# EAGLE design serduchotron 2 (EAGLE 8.3.2)
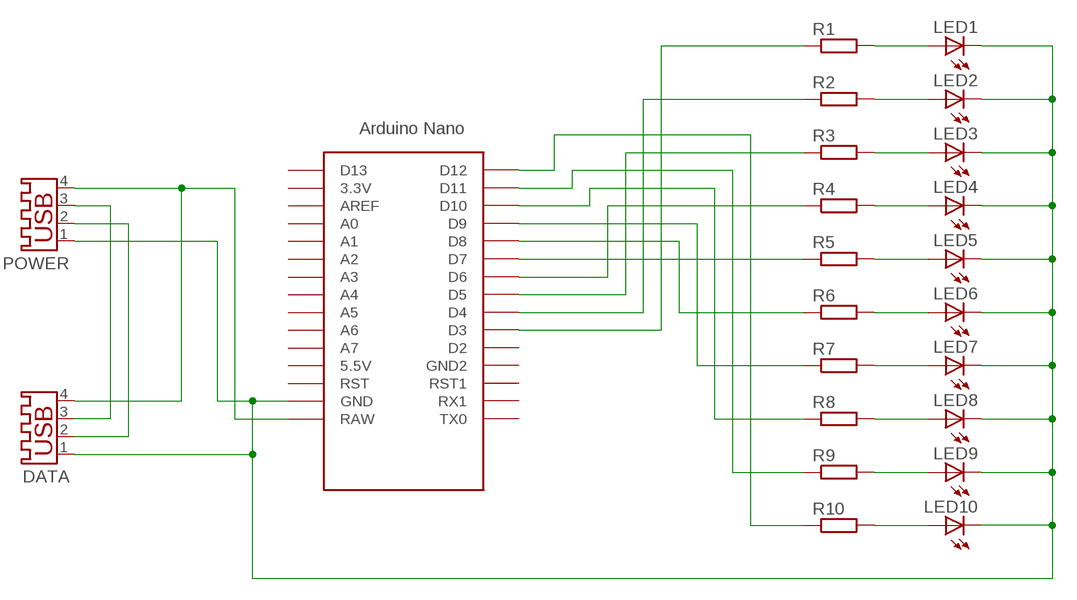
[diagram p0: schematic, sheet 1]

## Parts
DATA  USB-A003  [USB-A003]
LED1  LEDCHIP-LED0805  [CHIP-LED0805]
LED2  LEDCHIP-LED0805  [CHIP-LED0805]
LED3  LEDCHIP-LED0805  [CHIP-LED0805]
LED4  LEDCHIP-LED0805  [CHIP-LED0805]
LED5  LEDCHIP-LED0805  [CHIP-LED0805]
LED6  LEDCHIP-LED0805  [CHIP-LED0805]
LED7  LEDCHIP-LED0805  [CHIP-LED0805]
LED8  LEDCHIP-LED0805  [CHIP-LED0805]
LED9  LEDCHIP-LED0805  [CHIP-LED0805]
LED10  LEDCHIP-LED0805  [CHIP-LED0805]
POWER  USB-A003  [USB-A003]
R1  R-EU_M0805  [M0805]
R2  R-EU_M0805  [M0805]
R3  R-EU_M0805  [M0805]
R4  R-EU_M0805  [M0805]
R5  R-EU_M0805  [M0805]
R6  R-EU_M0805  [M0805]
R7  R-EU_M0805  [M0805]
R8  R-EU_M0805  [M0805]
R9  R-EU_M0805  [M0805]
R10  R-EU_M0805  [M0805]
U$1  NANO  [NANO]

## Nets
DATA+: DATA.2 POWER.2
DATA-: DATA.3 POWER.3
GND: DATA.1 LED1.C LED2.C LED3.C LED4.C LED5.C LED6.C LED7.C LED8.C LED9.C LED10.C POWER.1 U$1.GND
LED1: LED1.A R1.2
LED2: LED2.A R2.2
LED3: LED3.A R3.2
LED4: LED4.A R4.2
LED5: LED5.A R5.2
LED6: LED6.A R6.2
LED7: LED7.A R7.2
LED8: LED8.A R8.2
LED9: LED9.A R9.2
LED10: LED10.A R10.2
R1: R1.1 U$1.D3
R2: R2.1 U$1.D4
R3: R3.1 U$1.D5
R4: R4.1 U$1.D6
R5: R5.1 U$1.D7
R6: R6.1 U$1.D8
R7: R7.1 U$1.D9
R8: R8.1 U$1.D10
R9: R9.1 U$1.D11
R10: R10.1 U$1.D12
VCC: DATA.4 POWER.4 U$1.RAW
Unconnected: U$1.3.3V U$1.5V(5.5V) U$1.A0 U$1.A1 U$1.A2 U$1.A3 U$1.A4 U$1.A5 U$1.A6 U$1.A7 U$1.AREF U$1.D2 U$1.D13 U$1.GND1(GND2) U$1.ICSP1 U$1.ICSP2 U$1.ICSP3 U$1.ICSP4 U$1.ICSP5 U$1.ICSP6 U$1.RST U$1.RST1 U$1.RX1 U$1.TX0

## Library data of the parts
DATA POWER = con-yamaichi:USB-A003: USB connector; OC_FARNELL: unknown; OC_NEWARK: unknown
LED1-LED10 = led:LED: LED OSRAM: - CHIPLED LG R971, LG N971, LY N971, LG Q971, LY Q971, LO R971, LY R971 LH N974, LH R974 LS Q976, LO Q976, LY Q976 LO Q996 - Hyper CHIPLED LW Q18S LB Q993, LB Q99A, LB R99A - SideLED LS A670, LO A670, LY A670, LG A670, LP A670 LB A673, LV A673, LT A673, LW A673 LH A674 LY A675 LS A676, LA A676, LO A676, LY A676, LW A676 LS A679, LY A679, LG A679 - Hyper Micro SIDELED® LS Y876, LA Y876, LO Y876, LY Y876 LT Y87S - SmartLED LW L88C, LW L88S LB L89C, LB L89S, LG L890 LS L89K, LO L89K, LY L89K LS L896, LA L896, LO L896, LY L896 - TOPLED LS T670, LO T670, LY T670, LG T670, LP T670 LSG T670, LSP T670, LSY T670, LOP T670, LYG T670 LG T671, LOG T671, LSG T671 LB T673, LV T673, LT T673, LW T673 LH T674 LS T676, LA T676, LO T676, LY T676, LB T676, LH T676, LSB T676, LW T676 LB T67C, LV T67C, LT T67C, LS T67K, LO T67K, LY T67K, LW E67C LS E67B, LA E67B, LO E67B, LY E67B, LB E67C, LV E67C, LT E67C LW T67C LS T679, LY T679, LG T679 LS T770, LO T770, LY T770, LG T770, LP T770 LB T773, LV T773, LT T773, LW T773 LH T774 LS E675, LA E675, LY E675, LS T675 LS T776, LA T776, LO T776, LY T776, LB T776 LHGB T686 LT T68C, LB T68C - Hyper Mini TOPLED® LB M676 - Mini TOPLED Santana® LG M470 LS M47K, LO M47K, LY M47K Source: http://www.osram.convergy.de LUXEON: - LUMILED® LXK2-PW12-R00, LXK2-PW12-S00, LXK2-PW14-U00, LXK2-PW14-V00 LXK2-PM12-R00, LXK2-PM12-S00, LXK2-PM14-U00 LXK2-PE12-Q00, LXK2-PE12-R00, LXK2-PE12-S00, LXK2-PE14-T00, LXK2-PE14-U00 LXK2-PB12-K00, LXK2-PB12-L00, LXK2-PB12-M00, LXK2-PB14-N00, LXK2-PB14-P00, LXK2-PB14-Q00 LXK2-PR12-L00, LXK2-PR12-M00, LXK2-PR14-Q00, LXK2-PR14-R00 LXK2-PD12-Q00, LXK2-PD12-R00, LXK2-PD12-S00 LXK2-PH12-R00, LXK2-PH12-S00 LXK2-PL12-P00, LXK2-PL12-Q00, LXK2-PL12-R00 Source: www.luxeon.com KINGBRIGHT: KA-3528ASYC Source: www.kingbright.com
R1-R10 = rcl:R-EU_: RESISTOR, European symbol
U$1 = Arduino-clone:NANO: Arduino Nano

## Board
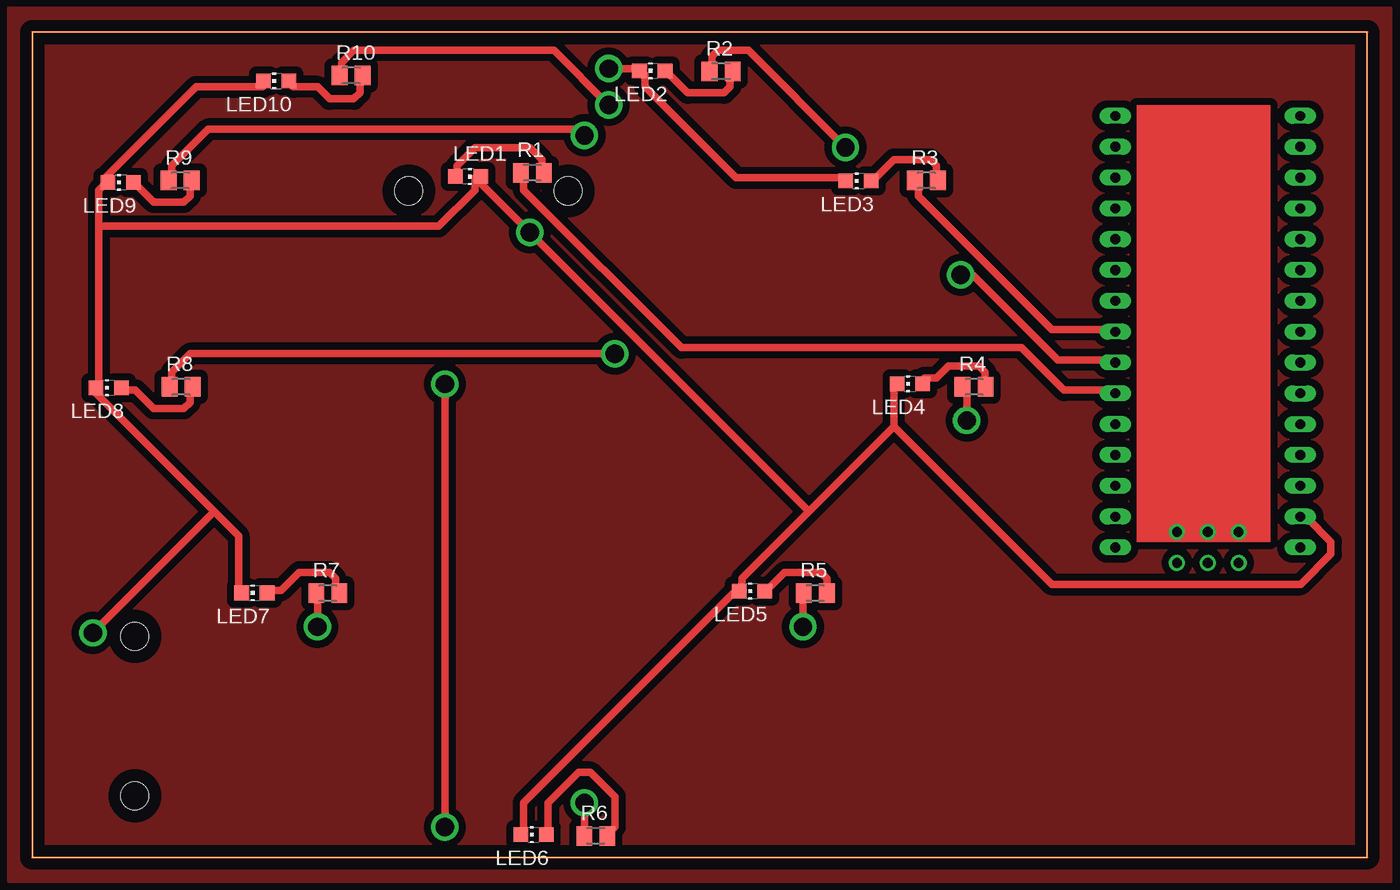
[diagram p1: board, top side]
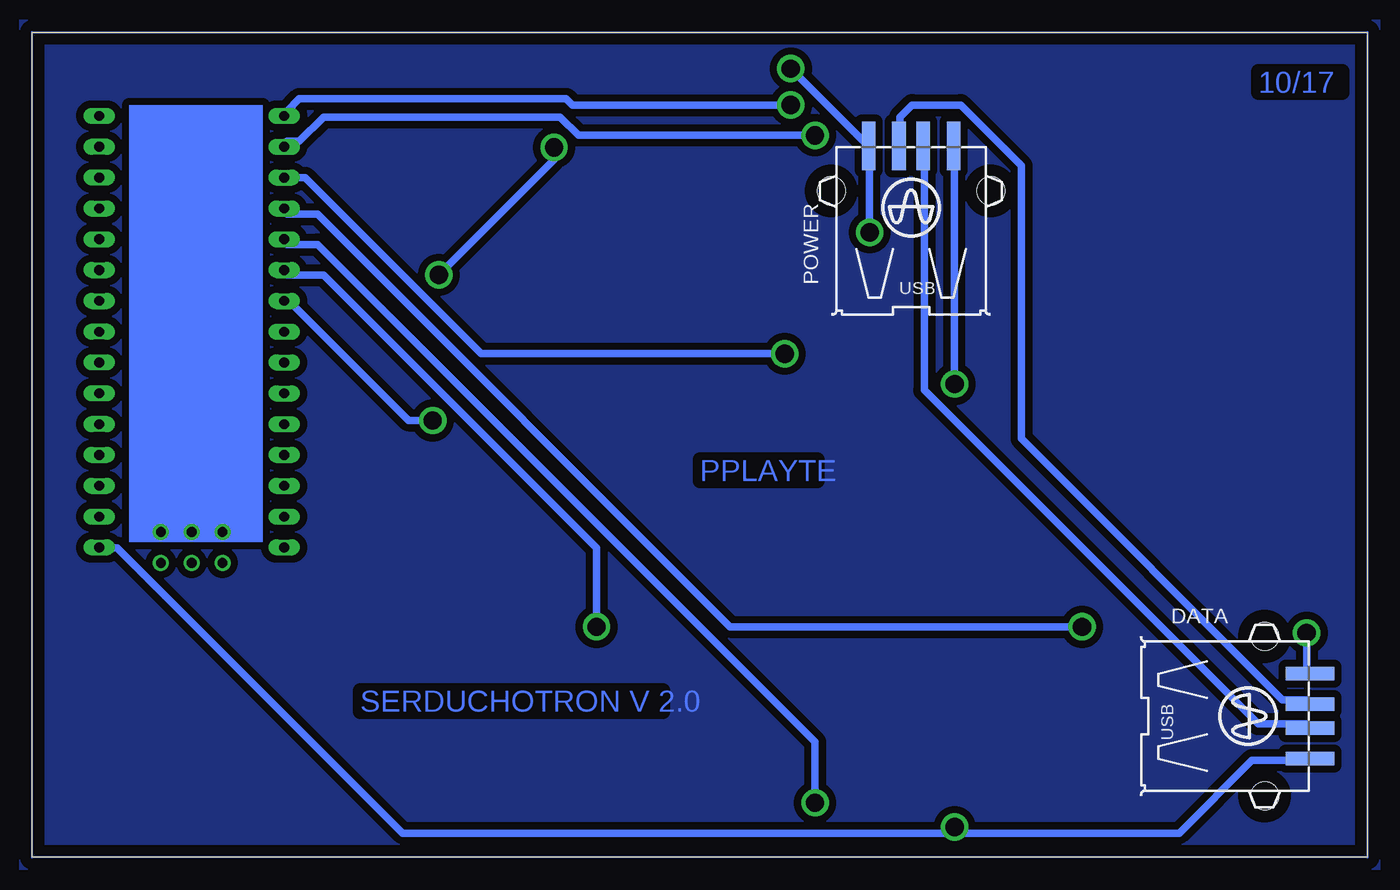
[diagram p2: board, bottom side, seen from below]

Size 110 x 68 mm. Coordinates in mm from the lower left corner, seen from the top.
Outline: 0,0 110,0 110,68 0,68 0,0
Copper layers (1*16): Top 0.035mm / dielectric 1.5mm / Bottom 0.035mm
Design rules "default *": minimum track width 0.6mm, minimum drill 1.5mm, track to track 0.6mm, track to pad 0.6mm, pad to pad 0.6mm, via to via 0.6mm, smd to smd 0.6mm, copper to edge 40mil, drill to drill 6mil, minimum pad ring 10mil, minimum via ring 8mil, stop-mask expansion 4mil, vias tented up to drill 0mil, thermal gap 10mil

### Footprints (pad centres in the part's own frame; a part is rotated, then mirrored left to right if it is on the bottom)
USB-A003 = smd 1.12 x 4: 1 -3.5,14; 2 -1,14; 3 1,14; 4 3.5,14 | hole 2.3: -6.57,10.28; 6.57,10.28
CHIP-LED0805 = smd 1.2 x 1.2: A 0,-1.05; C 0,1.05
M0805 = smd 1.3 x 1.6: 1 -0.95,0; 2 0.95,0
NANO = drill 0.8 long: 3.3V -10.16,24.13; 5V -10.16,-1.27; A0 -10.16,19.05; A1 -10.16,16.51; A2 -10.16,13.97; A3 -10.16,11.43; A4 -10.16,8.89; A5 -10.16,6.35; A6 -10.16,3.81; A7 -10.16,1.27; AREF -10.16,21.59; D2 5.08,1.27; D3 5.08,3.81; D4 5.08,6.35; D5 5.08,8.89; D6 5.08,11.43; D7 5.08,13.97; D8 5.08,16.51; D9 5.08,19.05; D10 5.08,21.59; D11 5.08,24.13; D12 5.08,26.67; D13 -10.16,26.67; GND -10.16,-6.35; GND1 5.08,-1.27; RAW -10.16,-8.89; RST -10.16,-3.81; RST1 5.08,-3.81; RX1 5.08,-6.35; TX0 5.08,-8.89 | drill 0.8: ICSP1 -5.08,-10.16; ICSP2 -5.08,-7.62; ICSP3 -2.54,-10.16; ICSP4 -2.54,-7.62; ICSP5 0,-10.16; ICSP6 0,-7.62

### Placement (x,y rotation side)
DATA  18.73,11.64 270 bottom
LED1  35.91,56.1 270 top
LED2  51.09,64.82 90 top
LED3  68.09,55.74 90 top
LED4  72.31,39.03 90 top
LED5  59.31,21.95 90 top
LED6  41.31,1.87 90 top
LED7  18.31,21.79 90 top
LED8  6.31,38.71 90 top
LED9  7.31,55.63 90 top
LED10  20.09,63.98 90 top
POWER  37.59,44.64 0 bottom
R1  41.2,56.42 0 top
R2  56.76,64.77 0 top
R3  73.68,55.77 0 top
R4  77.6,38.77 0 top
R5  64.52,21.77 0 top
R6  46.44,1.77 0 top
R7  24.36,21.77 0 top
R8  12.28,38.77 0 top
R9  12.2,55.77 0 top
R10  26.28,64.42 0 top
U$1  94.32,34.43 0 bottom

### Tracks (layer width: path | path; a pad name or v marks a point on that pad's centre or on a via)
DATA+
  Bottom 0.6: DATA.2 5,13 7,13 28.5,34.5 28.5,57 33.5,62 37.5,62 38.5,61 38.5,59 POWER.2
DATA-
  Bottom 0.6: DATA.3 5,11 9,11 36.5,38.5 36.5,58.5 POWER.3
GND  (via drill 1.5)
  Top 0.6: LED6.C 40.5,2 40.5,4.5 58,22 LED5.C 58.5,22 58.5,23 64,28.5 | 71,35.5 71,39 LED4.C | 64,28.5 71,35.5 | 71,35.5 84,22.5 104.5,22.5 107,25 107,26 105,28 104.5,28 U$1.GND | LED3.C 67,56 58,56 50.5,63.5 50.5,64.5 LED2.C 50,65 v47.5,65 | 5.5,52 5.5,55 6,55.5 LED9.C 6,56 13.5,63.5 19,63.5 LED10.C | 5.5,52 5.5,39 LED8.C 5,38.5 15,28.5 | 15,28.5 17,26.5 17,22 LED7.C | 36.5,56 36.5,55 33.5,52 5.5,52 | 15,28.5 v5,18.5 | 36.5,56 v41,51.5 64,28.5 | 36.5,56 LED1.C
  Bottom 0.6: v47.5,65 41.5,59 POWER.1 41,58.5 v41,51.5 | v5,18.5 5,15.5 DATA.1
LED1
  Top 0.6: LED1.A 35,56.5 35,57 36.5,58.5 41,58.5 42,57.5 42,56.5 R1.2
LED2
  Top 0.6: LED2.A 52.5,64.5 54,63 57,63 57.5,63.5 57.5,64.5 R2.2
LED3
  Top 0.6: LED3.A 69.5,56 71,57.5 74,57.5 74.5,57 74.5,56 R3.2
LED4
  Top 0.6: LED4.A 73.5,39.5 74.5,39.5 75.5,40.5 78,40.5 78.5,40 78.5,39 R4.2
LED5
  Top 0.6: LED5.A 60.5,22 62,23.5 65,23.5 65.5,23 65.5,22 R5.2
LED6
  Top 0.6: LED6.A 42.5,2 42.5,4.5 45,7 46,7 48,5 48,2.5 47.5,2 R6.2
LED7
  Top 0.6: LED7.A 19.5,22 20.5,22 22,23.5 24.5,23.5 25,23 25,22 R7.2
LED8
  Top 0.6: LED8.A 7.5,38.5 8.5,38.5 10,37 12.5,37 13,37.5 13,38.5 R8.2
LED9
  Top 0.6: LED9.A 8.5,55.5 10,54 12.5,54 13,54.5 13,55.5 R9.2
LED10
  Top 0.6: LED10.A 21.5,63.5 23.5,63.5 24.5,62.5 26.5,62.5 27,63 27,64 R10.2
N$1
  Top 0.152: 0,68 0,0 110,0 110,68 0,68
N$2
  Bottom 0.152: 0,68 0,0 110,0 110,68 0,68
N$3
  pour Bottom: -1,69 -1,-1 111,-1 111,69
N$4
  pour Top: -2,70 -2,-2 112,-2 112,70
R1
  Top 0.6: R1.1 40.5,56 40.5,55 53.5,42 81.5,42 85,38.5 89,38.5 U$1.D3
R2  (via drill 1.5)
  Top 0.6: v67,58.5 59,66.5 56.5,66.5 56,66 56,65 R2.1 | v76.5,48 77.5,48 84.5,41 89,41 U$1.D4
  Bottom 0.6: v67,58.5 67,57.5 v76.5,48
R3
  Top 0.6: R3.1 73,55.5 73,54.5 84,43.5 89,43.5 U$1.D5
R4  (via drill 1.5)
  Top 0.6: v77,36 77,38.5 R4.1
  Bottom 0.6: v77,36 79,36 89,46 U$1.D6
R5  (via drill 1.5)
  Top 0.6: v63.5,19 63.5,21.5 R5.1
  Bottom 0.6: v63.5,19 63.5,25.5 86,48 89,48 U$1.D7
R6  (via drill 1.5)
  Top 0.6: v45.5,4.5 45.5,2 R6.1
  Bottom 0.6: v45.5,4.5 45.5,9.5 86.5,50.5 89,50.5 U$1.D8
R7  (via drill 1.5)
  Top 0.6: v23.5,19 23.5,21.5 R7.1
  Bottom 0.6: v23.5,19 52.5,19 86.5,53 89,53 U$1.D9
R8  (via drill 1.5)
  Top 0.6: v48,41.5 13,41.5 11.5,40 11.5,39 R8.1
  Bottom 0.6: v48,41.5 73,41.5 87.5,56 89,56 U$1.D10
R9  (via drill 1.5)
  Top 0.6: v45.5,59.5 45,60 14.5,60 11.5,57 11.5,56 R9.1
  Bottom 0.6: v45.5,59.5 65,59.5 66.5,61 86,61 88,59 89,59 U$1.D11
R10  (via drill 1.5)
  Top 0.6: v47.5,62 43,66.5 26.5,66.5 25.5,65.5 25.5,64.5 R10.1
  Bottom 0.6: v47.5,62 65.5,62 66,62.5 88,62.5 89,61.5 U$1.D12
VCC  (via drill 1.5)
  Top 0.6: v34,2.5 v34,39
  Bottom 0.6: 34,2 15.5,2 9.5,8 5,8 DATA.4 | 34,2 79.5,2 103,25.5 104,25.5 U$1.RAW | v34,39 34,58.5 POWER.4 | 34,2 v34,2.5
(copper drawn outside any net)
  shapes: Bottom area x1, Top area x1

### Text on the board
Bottom: 10/17 | PPLAYTE | SERDUCHOTRON V 2.0